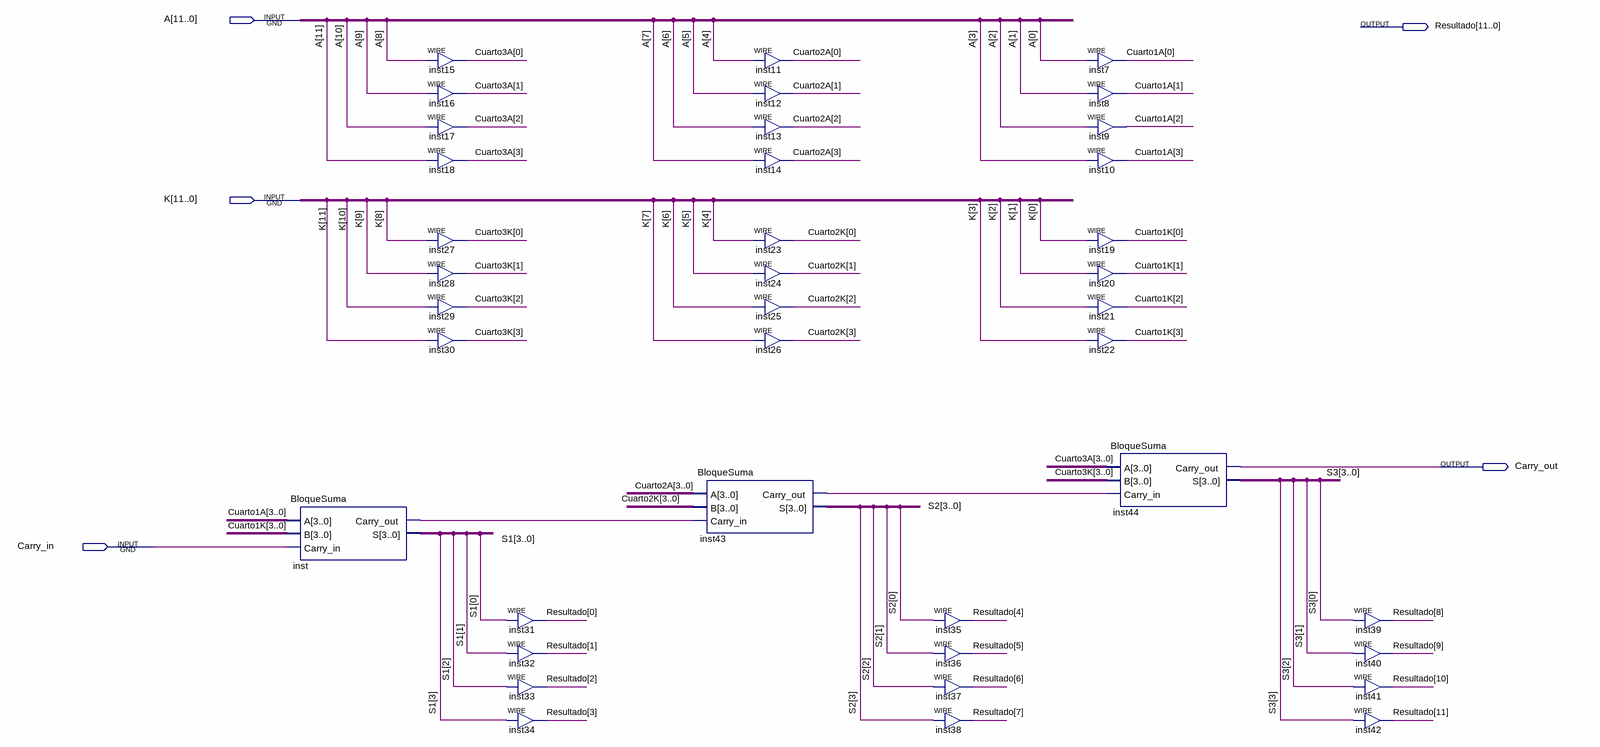
[diagram p0: schematic sheet]
// Quartus schematic Sumador.bdf as structural Verilog: 39 symbols, 5 pins
module Sumador (
  input  [11:0] A,
  input  [11:0] K,
  input  Carry_in,
  output [11:0] Resultado,
  output Carry_out
);

  wire inst43_carry_out, inst_carry_out;
  wire [3:0] Cuarto1A, Cuarto1K, Cuarto2A, Cuarto2K, Cuarto3A, Cuarto3K, S1, S2, S3;

  BloqueSuma inst (.A(Cuarto1A), .B(Cuarto1K), .Carry_in(Carry_in), .Carry_out(inst_carry_out), .S(S1));
  assign Cuarto3A[0] = A[8];  // WIRE inst15
  assign Cuarto3A[1] = A[9];  // WIRE inst16
  assign Cuarto3A[2] = A[10];  // WIRE inst17
  assign Cuarto3A[3] = A[11];  // WIRE inst18
  assign Cuarto3K[0] = K[8];  // WIRE inst27
  assign Cuarto3K[1] = K[9];  // WIRE inst28
  assign Cuarto3K[2] = K[10];  // WIRE inst29
  assign Cuarto3K[3] = K[11];  // WIRE inst30
  assign Resultado[0] = S1[0];  // WIRE inst31
  assign Resultado[1] = S1[1];  // WIRE inst32
  assign Resultado[2] = S1[2];  // WIRE inst33
  assign Resultado[3] = S1[3];  // WIRE inst34
  BloqueSuma inst43 (.A(Cuarto2A), .B(Cuarto2K), .Carry_in(inst_carry_out), .Carry_out(inst43_carry_out), .S(S2));
  assign Cuarto2A[0] = A[4];  // WIRE inst11
  assign Cuarto2A[1] = A[5];  // WIRE inst12
  assign Cuarto2A[2] = A[6];  // WIRE inst13
  assign Cuarto2A[3] = A[7];  // WIRE inst14
  assign Cuarto2K[0] = K[4];  // WIRE inst23
  assign Cuarto2K[1] = K[5];  // WIRE inst24
  assign Cuarto2K[2] = K[6];  // WIRE inst25
  assign Cuarto2K[3] = K[7];  // WIRE inst26
  assign Resultado[4] = S2[0];  // WIRE inst35
  assign Resultado[5] = S2[1];  // WIRE inst36
  assign Resultado[6] = S2[2];  // WIRE inst37
  assign Resultado[7] = S2[3];  // WIRE inst38
  assign Cuarto1A[0] = A[0];  // WIRE inst7
  assign Cuarto1A[1] = A[1];  // WIRE inst8
  assign Cuarto1A[2] = A[2];  // WIRE inst9
  assign Cuarto1A[3] = A[3];  // WIRE inst10
  assign Cuarto1K[0] = K[0];  // WIRE inst19
  assign Cuarto1K[1] = K[1];  // WIRE inst20
  assign Cuarto1K[2] = K[2];  // WIRE inst21
  assign Cuarto1K[3] = K[3];  // WIRE inst22
  BloqueSuma inst44 (.A(Cuarto3A), .B(Cuarto3K), .Carry_in(inst43_carry_out), .Carry_out(Carry_out), .S(S3));
  assign Resultado[8] = S3[0];  // WIRE inst39
  assign Resultado[9] = S3[1];  // WIRE inst40
  assign Resultado[10] = S3[2];  // WIRE inst41
  assign Resultado[11] = S3[3];  // WIRE inst42
endmodule
